# Altium schematic sheet NRF52820.SchDoc
size A4
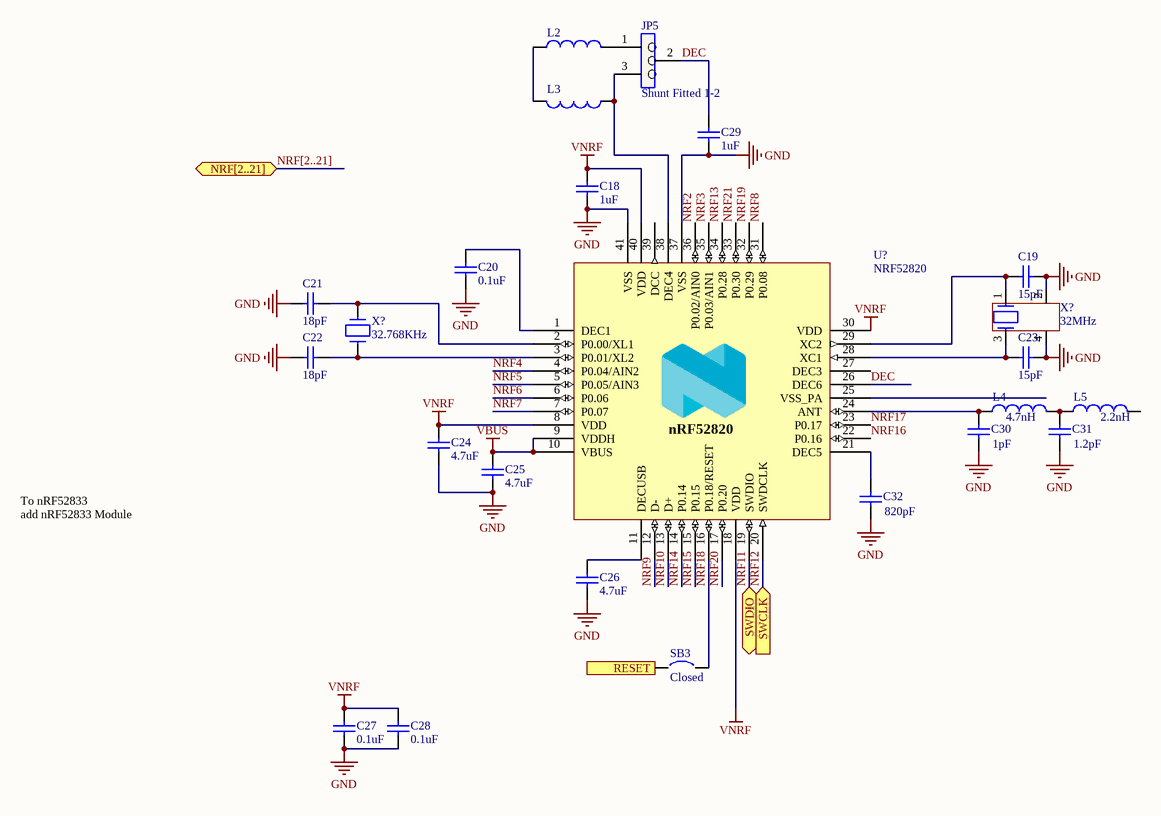
[diagram p0: NRF52820.SchDoc]

## Parts
(Parts that share a designator on the sheet are numbered #1, #2 ... from top to bottom, then left to right.)
C18  value 1uF  [C0603[1608X92]]  (hidden comment: 1uF 6.3V 0603)
C19  value 15pF  [C0603[1608X92]]  (hidden comment: 15pF 50V 0603)
C20  value 0.1uF  [C0603[1608X92]]  (hidden comment: 0.1uF 16V 0603)
C21  value 18pF  [C0603[1608X92]]  (hidden comment: 18pF 50V 0603)
C22  value 18pF  [C0603[1608X92]]  (hidden comment: 18pF 50V 0603)
C23  value 15pF  [C0603[1608X92]]  (hidden comment: 15pF 50V 0603)
C24  value 4.7uF  [C0603[1608X92]]  (hidden comment: 4.7uF 16V 0603)
C25  value 4.7uF  [C0603[1608X92]]  (hidden comment: 4.7uF 16V 0603)
C26  value 4.7uF  [C0603[1608X92]]  (hidden comment: 4.7uF 16V 0603)
C27  value 0.1uF  [C0603[1608X92]]  (hidden comment: 0.1uF 16V 0603)
C28  value 0.1uF  [C0603[1608X92]]  (hidden comment: 0.1uF 16V 0603)
C29  value 1uF  [C0603[1608X92]]  (hidden comment: 1uF 6.3V 0603)
C30  CAPACITOR 0603  [C0603[1608X92]]  (value not drawn)
C31  CAPACITOR 0603  [C0603[1608X92]]  (value not drawn)
C32  CAPACITOR 0603  [C0603[1608X92]]  (value not drawn)
JP5  value Shunt Fitted 1-2  [HDR1X3]  (hidden comment: Jumper_Header 3x1 Fitted 1-2)
L2  INDUCTOR 0603  [IND0603]  (value not drawn)
L3  INDUCTOR 0603  [IND0603]  (value not drawn)
L4  INDUCTOR 0603  [IND0603]  (value not drawn)
L5  INDUCTOR 0603  [IND0603]  (value not drawn)
SB3  Closed  [SB_0603]
U?  NRF52820  [QFN-40]
X?#1  value 32MHz  [4-SMD]  (hidden comment: NX2016SA 32MHz)
X?#2  value 32.768KHz  [2-SMD]  (hidden comment: NX3215SA 32.768KHz)

## Ports
NRF[2..21] (bidir), RESET (in), SWCLK (in), SWDIO (bidir)

## Nets
GND: C18.1 C19.1 C20.2 C21.2 C22.2 C23.1 C24.1 C25.1 C26.1 C27.2 C28.2 C29.1 C30.1 C31.1 C32.1 U?.37(VSS) U?.41(VSS) X?#1.2 X?#1.4
VBUS: C25.2 U?.9(VDDH) U?.10(VBUS)
VNRF: C18.2 C24.2 C27.1 C28.1 U?.8(VDD) U?.18(VDD) U?.30(VDD) U?.40(VDD)
DEC: C29.2 JP5.2 U?.26(DEC6)
NRF2: U?.36(P0.02/AIN0)
NRF3: U?.35(P0.03/AIN1)
NRF4: U?.4(P0.04/AIN2)
NRF5: U?.5(P0.05/AIN3)
NRF6: U?.6(P0.06)
NRF7: U?.7(P0.07)
NRF8: U?.31(P0.08)
NRF9: U?.12(D-)
NRF10: U?.13(D+)
NRF11: U?.19(SWDIO) ; port SWDIO
NRF12: U?.20(SWDCLK) ; port SWCLK
NRF13: U?.34(P0.28)
NRF14: U?.14(P0.14)
NRF15: U?.15(P0.15)
NRF16: U?.22(P0.16)
NRF17: U?.23(P0.17)
NRF18: SB3.2 U?.16(P0.18/RESET)
NRF19: U?.32(P0.29)
NRF20: U?.17(P0.20)
NRF21: U?.33(P0.30)
RESET: SB3.1 ; port RESET
NetC19_2: C19.2 U?.29(XC2) X?#1.1
NetC20_1: C20.1 U?.1(DEC1)
NetC21_1: C21.1 U?.2(P0.00/XL1) X?#2.2(X2)
NetC22_1: C22.1 U?.3(P0.01/XL2) X?#2.1(X1)
NetC23_2: C23.2 U?.28(XC1) X?#1.3
NetC26_2: C26.2 U?.11(DECUSB)
NetC30_2: C30.2 L4.1 U?.24(ANT)
NetC31_2: C31.2 L4.2 L5.1
NetC32_2: C32.2 U?.21(DEC5)
NetJP5_1: JP5.1 L2.2
NetJP5_3: JP5.3 L3.1 U?.38(DEC4)
NetL2_1: L2.1 L3.2

Not connected (* = marked no-connect by the designer): L5 2; U? 25(VSS_PA) 27(DEC3) 39(DCC)

## Buses and harness runs
bus NRF[2..21] = port NRF[2..21]

## Notes on the sheet
- (near L4) 4.7nH
- (near L5) 2.2nH
- (near C30) 1pF
- (near C31) 1.2pF
- (near C32) 820pF
- To nRF52833
  add nRF52833 Module
- (in symbol NRF52820) nRF52820

## Library data of the parts
C18 C29 = CAP_1uF_6.3V_0603_10%: 1uF 6.3V 10% 0603 (1608 Metric); PartNumber: GRM188R60J105KA01D; Manufacturer: Murata; TemperatureCoefficient: X5R; Mounting Technology: Surface Mount; PackageReference: 0603; PackageDescription: 0603 (1608 Metric); Voltage: 6.3V; Tolerance: 10%
C19 C23 = CAP_15pF_50V_0603_1%: 15pF 50V 1% 0603 (1608 Metric); PartNumber: 06035A150FAT2A; Manufacturer: AVX Corporation; TemperatureCoefficient: C0G; Mounting Technology: Surface Mount; PackageReference: 0603; PackageDescription: 0603 (1608 Metric); Voltage: 50V; Tolerance: 1%
C20 C27 C28 = CAP_0.1uF_16V_0603_10%: 0.1uF 16V 10% 0603 (1608 Metric); PartNumber: GCM188R71C104KA37D; Manufacturer: Murata; TemperatureCoefficient: X7R; Mounting Technology: Surface Mount; PackageReference: 0603; PackageDescription: 0603 (1608 Metric); Voltage: 16V; Tolerance: 10%
C21 C22 = CAP_18pF_50V_0603_1%: 18pF 50V 1% 0603 (1608 Metric); PartNumber: 06035A180FAT2A; Manufacturer: AVX Corporation; TemperatureCoefficient: C0G; Mounting Technology: Surface Mount; PackageReference: 0603; PackageDescription: 0603 (1608 Metric); Voltage: 50V; Tolerance: 1%
C24-C26 = CAP_4.7uF_16V_0603_10%: 4.7uF 16V 10% 0603 (1608 Metric); PartNumber: GRM188R61A475KE15D; Manufacturer: Murata; TemperatureCoefficient: X5R; Mounting Technology: Surface Mount; PackageReference: 0603; PackageDescription: 0603 (1608 Metric); Voltage: 16V; Tolerance: 10%
C30-C32 = CAP 0603: Empty CAPACITOR 0603 (1608 Metric); Mounting Technology: Surface Mount; PackageReference: 0603; PackageDescription: 0603 (1608 Metric)
JP5 = Jumper_Header 3x1 Fitted 1-2: Header, 3x1, 2,54mm, VR, TH, Height 5.84mm/2.54mm - Shunt Fitted 1-2 by default; Internal_Part_Number: MCD-00684; Part_Type: Connector; Manufacturer_Part_Number: TSW-103-07-F-S; Manufacturer: SAMTEC; Provided_By: SUBCO; Status: Released; ComponentLink1Description: Datasheet; ComponentLink1URL: http://tunmcdsvn.tun.st.com/Component_Datasheet_Library/Trunk/Connectors/Samtec_TSW-HTSW-series; ECCN_US: n/a; ECCN_EU: n/a
L2-L5 = IND 0603: Empty INDUCTOR 0603; PackageReference: 0603; PackageDescription: 0603 (1608 metric); Mounting Technology: Surface Mount
SB3 = Circuit Breaker_close: Circuit Breaker; Published: 24-Mar-1999; Revision: July-2002: Re-released for DXP Platform.; Publisher: Altium Limited
U? = NRF52820: Multi-protocol Bluetooth Low Energy, IEEE 802.15.4, ANT and 2.4GHz proprietary system-on-chip; PartNumber: nRF52820-QDAA; Manufacturer: Nordic Semiconductor; PackageReference: QFN-40; Mounting Technology: Surface Mount
X?#1 = NX2016SA 32MHz: Crystal 32MHz, 6pF, +-10ppm, 60ohms max, SMD; PartNumber: NX2016SA-32MHZ-EXS00A-CS07977; Manufacturer: NDK; Mounting Technology: Surface Mount; PackageReference: 4-SMD; Type: Crystal_Osc
X?#2 = NX3215SA 32.768KHz: Crystal 32.768kHz, 6pF, +-20ppm, 50Kohms max, SMD; PartNumber: NX3215SA-32.768KHz-EXS00A-MU00525; Manufacturer: NDK; Mounting Technology: Surface Mount; PackageReference: 2-SMD; Type: Crystal_Osc